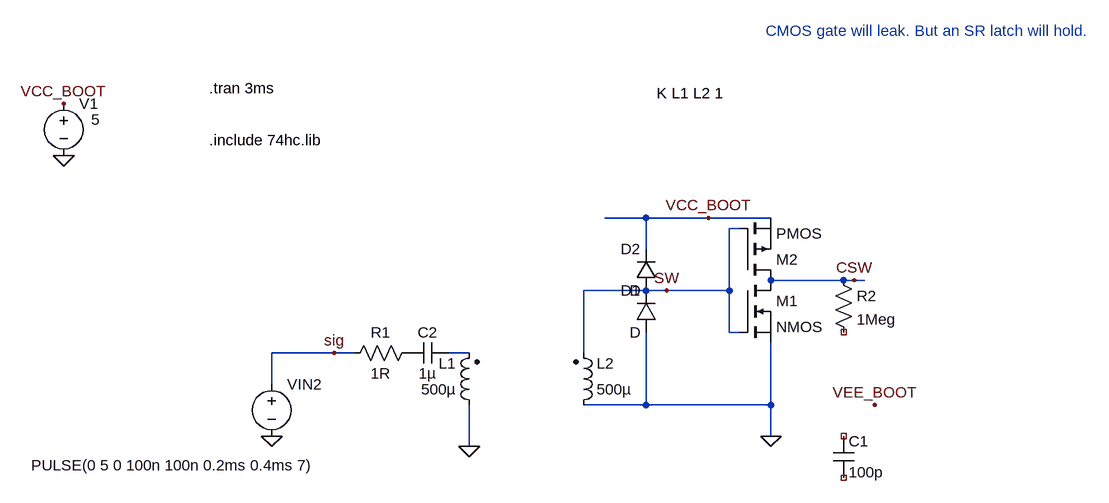
[diagram p0: schematic Draft56.asc]
Draft56.asc, the LTspice schematic file:
Version 4
SHEET 1 2756 1020
WIRE 1088 128 1024 128
WIRE 1184 128 1088 128
WIRE 1280 128 1184 128
WIRE 1232 144 1216 144
WIRE 1088 176 1088 128
WIRE 1392 224 1280 224
WIRE 1408 224 1392 224
WIRE 1424 224 1408 224
WIRE 1088 240 992 240
WIRE 1120 240 1088 240
WIRE 1216 240 1216 144
WIRE 1216 240 1120 240
WIRE 1216 304 1216 240
WIRE 1232 304 1216 304
WIRE 608 336 512 336
WIRE 640 336 608 336
WIRE 816 336 784 336
WIRE 992 336 992 240
WIRE 512 384 512 336
WIRE 1088 416 1088 304
WIRE 1088 416 992 416
WIRE 1280 416 1280 320
WIRE 1280 416 1088 416
WIRE 1280 464 1280 416
WIRE 816 480 816 416
FLAG 512 464 0
FLAG 1184 128 VCC_BOOT
FLAG 1440 416 VEE_BOOT
FLAG 1120 240 SW
FLAG 608 336 sig
FLAG 1408 224 CSW
FLAG 816 480 0
FLAG 192 -48 VCC_BOOT
FLAG 1280 464 0
FLAG 192 32 0
SYMBOL voltage 192 -64 R0
WINDOW 123 0 0 Left 0
WINDOW 39 0 0 Left 0
WINDOW 3 42 41 Left 2
SYMATTR Value 5
SYMATTR InstName V1
SYMBOL voltage 512 368 R0
WINDOW 123 0 0 Left 0
WINDOW 39 0 0 Left 0
WINDOW 3 -370 141 Left 2
SYMATTR Value PULSE(0 5 0 100n 100n 0.2ms 0.4ms 7)
SYMATTR InstName VIN2
SYMBOL res 736 320 R90
WINDOW 0 0 56 VBottom 2
WINDOW 3 32 56 VTop 2
SYMATTR InstName R1
SYMATTR Value 1R
SYMBOL nmos 1232 224 R0
SYMATTR InstName M1
SYMBOL pmos 1232 224 M180
SYMATTR InstName M2
SYMBOL ind2 832 432 R180
WINDOW 0 36 80 Left 2
WINDOW 3 36 40 Left 2
SYMATTR InstName L1
SYMATTR Value 500µ
SYMATTR Type ind
SYMBOL ind2 976 432 M180
WINDOW 0 36 80 Left 2
WINDOW 3 36 40 Left 2
SYMATTR InstName L2
SYMATTR Value 500µ
SYMATTR Type ind
SYMBOL res 1376 208 R0
SYMATTR InstName R2
SYMATTR Value 1Meg
SYMBOL cap 1376 464 R0
SYMATTR InstName C1
SYMATTR Value 100p
SYMBOL diode 1104 304 R180
WINDOW 0 24 64 Left 2
WINDOW 3 24 0 Left 2
SYMATTR InstName D1
SYMBOL cap 784 320 R90
WINDOW 0 0 32 VBottom 2
WINDOW 3 32 32 VTop 2
SYMATTR InstName C2
SYMATTR Value 1µ
SYMBOL diode 1104 240 R180
WINDOW 0 24 64 Left 2
WINDOW 3 24 0 Left 2
SYMATTR InstName D2
TEXT 416 -72 Left 2 !.tran 3ms
TEXT 416 8 Left 2 !.include 74hc.lib
TEXT 1272 -160 Left 2 ;CMOS gate will leak. But an SR latch will hold.
TEXT 1104 -64 Left 2 !K L1 L2 1

The netlist it stands for:
* Draft56.asc
V1 VCC_BOOT 0 5
VIN2 sig 0 PULSE(0 5 0 100n 100n 0.2ms 0.4ms 7)
R1 P001 sig 1R
M1 CSW SW 0 0 NMOS
M2 CSW SW VCC_BOOT VCC_BOOT PMOS
L1 0 N001 500µ
L2 0 SW 500µ
R2 CSW NC_01 1Meg
C1 NC_02 NC_03 100p
D1 0 SW D
C2 N001 P001 1µ
D2 SW VCC_BOOT D
.model D D
.lib standard.dio
.model NMOS NMOS
.model PMOS PMOS
.lib standard.mos
.tran 3ms
.include 74hc.lib
* CMOS gate will leak. But an SR latch will hold.
K L1 L2 1
.backanno
.end